# EAGLE design akabeacon_circle_MDBT40_type1 (EAGLE 9.6.2)
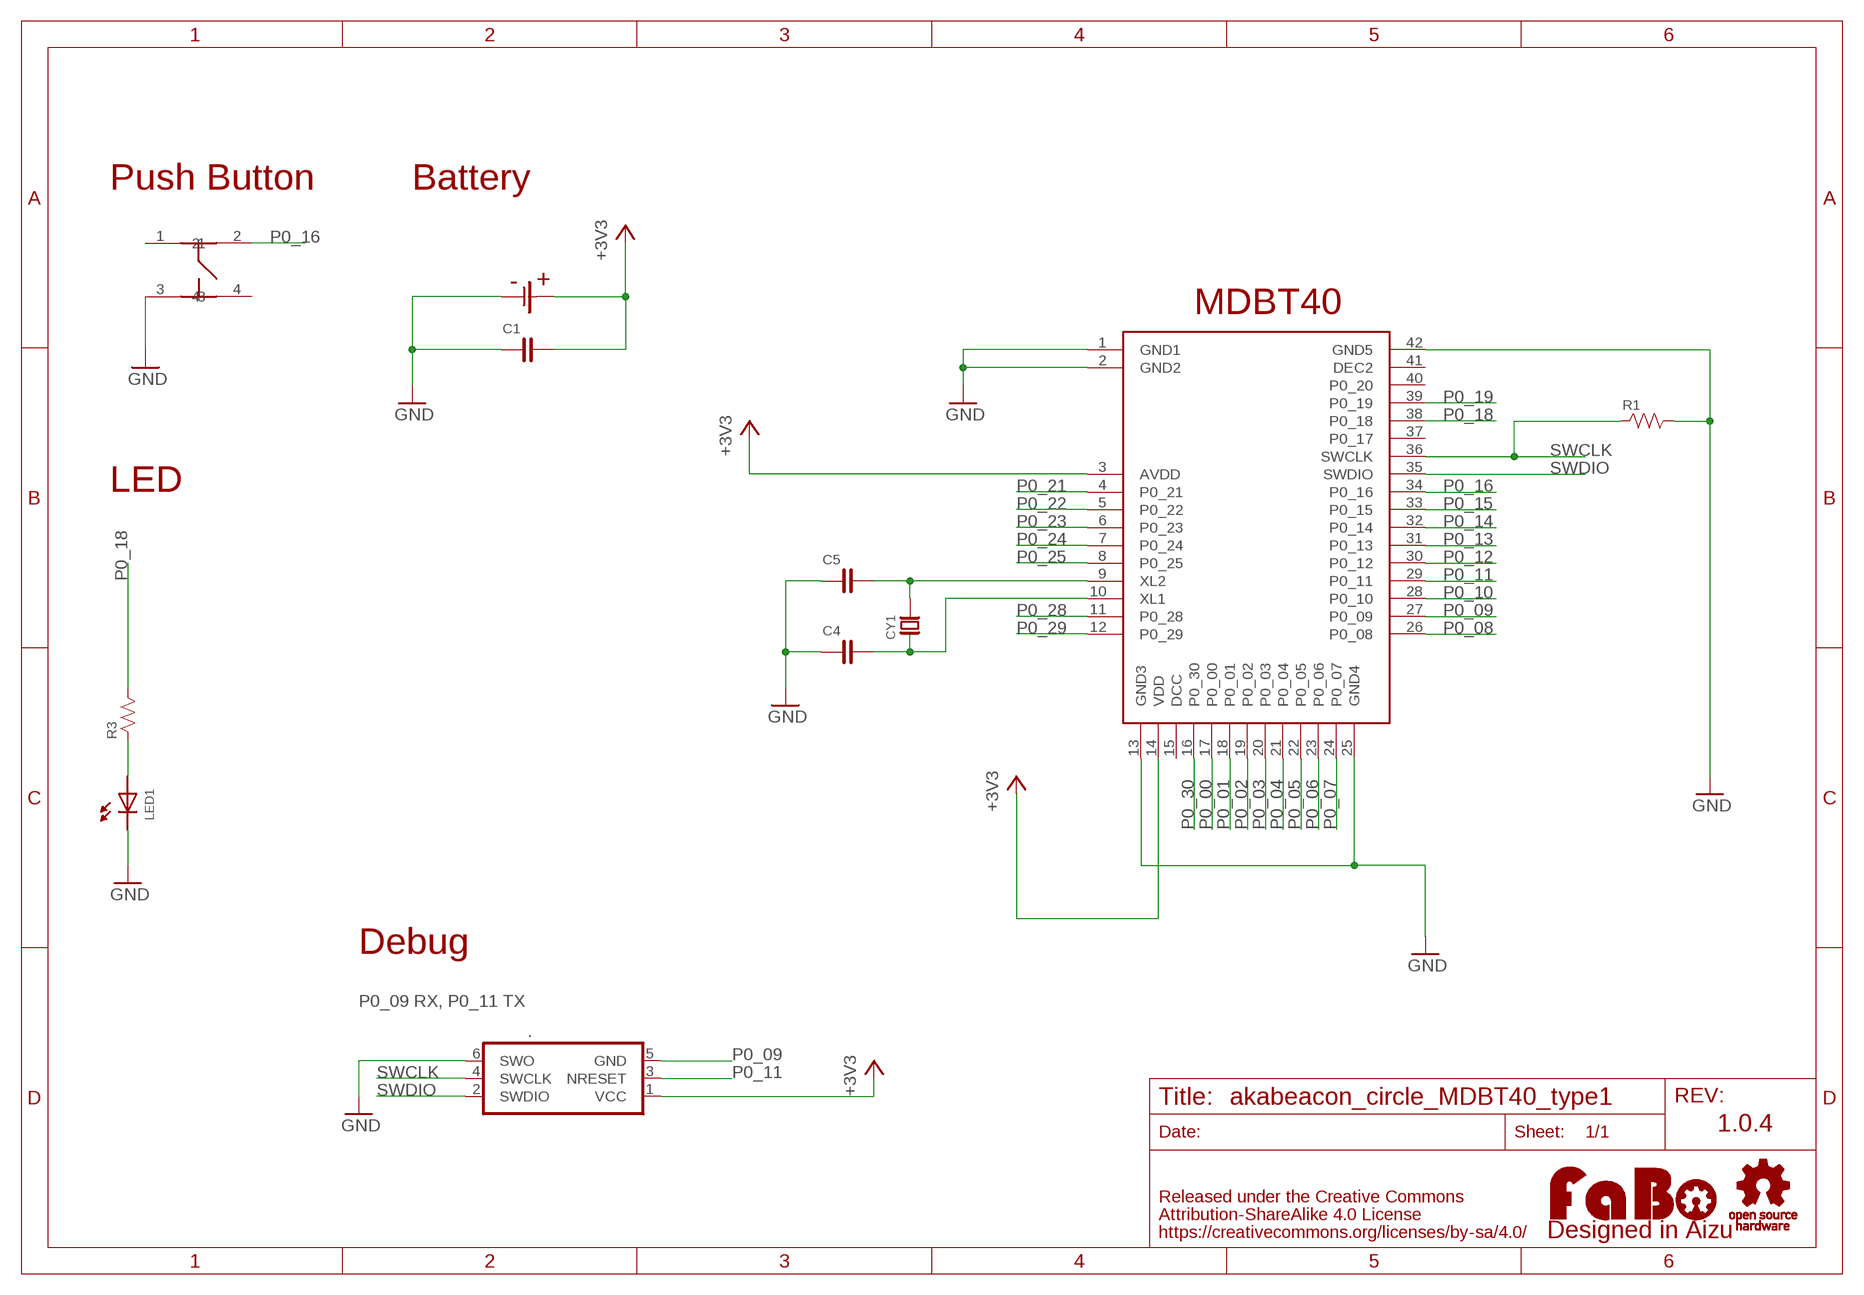
[diagram p0: schematic, sheet 1]

## Parts
.  TC2030-IDC-NL  [TC2030-IDC-NL]
C1  CAPACITOR-0603  [0603]
C4  CAPACITOR-0603  [0603]
C5  CAPACITOR-0603  [0603]
CY1  CRYSTALABS07  [ABRACON-ABS07-32.768KHZ]
LED1  LED-0603  [0603]
R1  RESISTOR-0603  [0603]
R3  RESISTOR-0603  [0603]
U$1  RAYTAC-MDBT40  [RAYTAC-MDBT40]
U$2  CH031-2477LF  [CH031-2477LF]
U$3  LOGO_FABO-M  [LOGO_FABO_MS]
U$4  LOGO_OSHW-M_BOTTOM  [LOGO_OSHW_M_BOTTOM]
U$5  SWICTH-4P(KMR2)  [SWITCH-4P(KMR2)]

## Nets
+3V3: ..1(VCC) C1.2 U$1.3(AVDD) U$1.14(VDD) U$2.+
GND: ..6(SWO) C1.1 C4.1 C5.1 LED1.CATHODE R1.2 U$1.1(GND1) U$1.2(GND2) U$1.13(GND3) U$1.25(GND4) U$1.42(GND5) U$2.- U$5.3
N$1: LED1.ANODE R3.1
N$7: C5.2 CY1.P$2 U$1.9(XL2)
N$8: C4.2 CY1.P$1 U$1.10(XL1)
P0_00: U$1.17(P0_00)
P0_01: U$1.18(P0_01)
P0_02: U$1.19(P0_02)
P0_03: U$1.20(P0_03)
P0_04: U$1.21(P0_04)
P0_05: U$1.22(P0_05)
P0_06: U$1.23(P0_06)
P0_07: U$1.24(P0_07)
P0_08: U$1.26(P0_08)
P0_09: ..5(GND) U$1.27(P0_09)
P0_10: U$1.28(P0_10)
P0_11: ..3(NRESET) U$1.29(P0_11)
P0_12: U$1.30(P0_12)
P0_13: U$1.31(P0_13)
P0_14: U$1.32(P0_14)
P0_15: U$1.33(P0_15)
P0_16: U$1.34(P0_16) U$5.2
P0_18: R3.2 U$1.38(P0_18)
P0_19: U$1.39(P0_19)
P0_21: U$1.4(P0_21)
P0_22: U$1.5(P0_22)
P0_23: U$1.6(P0_23)
P0_24: U$1.7(P0_24)
P0_25: U$1.8(P0_25)
P0_28: U$1.11(P0_28)
P0_29: U$1.12(P0_29)
P0_30: U$1.16(P0_30)
SWCLK: ..4(SWCLK) R1.1 U$1.36(SWCLK)
SWDIO: ..2(SWDIO) U$1.35(SWDIO)
Unconnected: U$1.15(DCC) U$1.37(P0_17) U$1.40(P0_20) U$1.41(DEC2) U$5.1 U$5.4

## Notes on the sheet
- Push Button | Battery
- MDBT40
- LED
- Debug
- P0_09 RX, P0_11 TX
- 1.0.4

## Library data of the parts
. = TagConnect:TC2030-IDC: Tag-Connect In Circuit Programming & Debug Cable 6 Pin http://www.tag-connect.com
C1 C4 C5 = FaBo-Capacitor:CAPACITOR: CAPACITOR
CY1 = FaBo-Crystal:CRYSTAL
LED1 = FaBo-LED:LED
R1 R3 = FaBo-Resistors:RESISTOR: RESISTOR
U$1 = FaBo-BT:RAYTAC-MDBT40
U$2 = FaBo-Supply:CH031-2477LF
U$3 = FaBo-Logo:LOGO_FABO
U$4 = FaBo-Logo:LOGO_OSHW
U$5 = gclue-test:SWICTH-4P(KMR2)

## Board
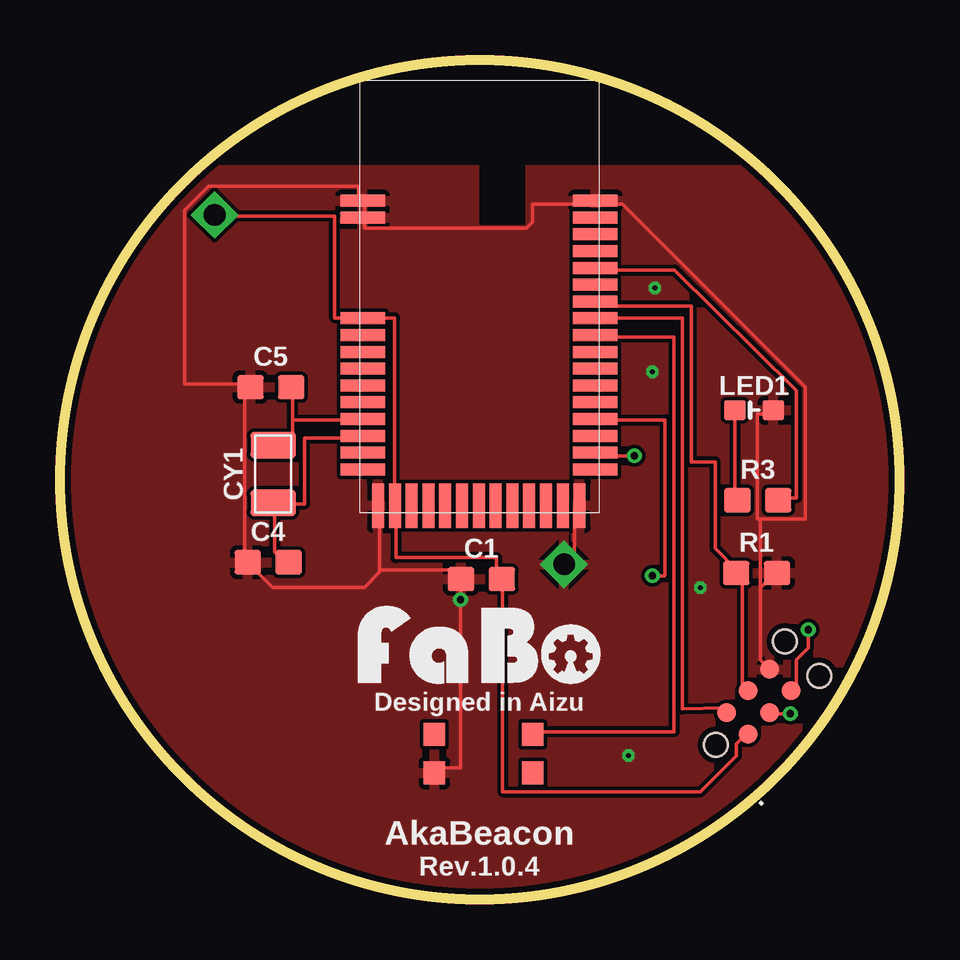
[diagram p1: board, top side]
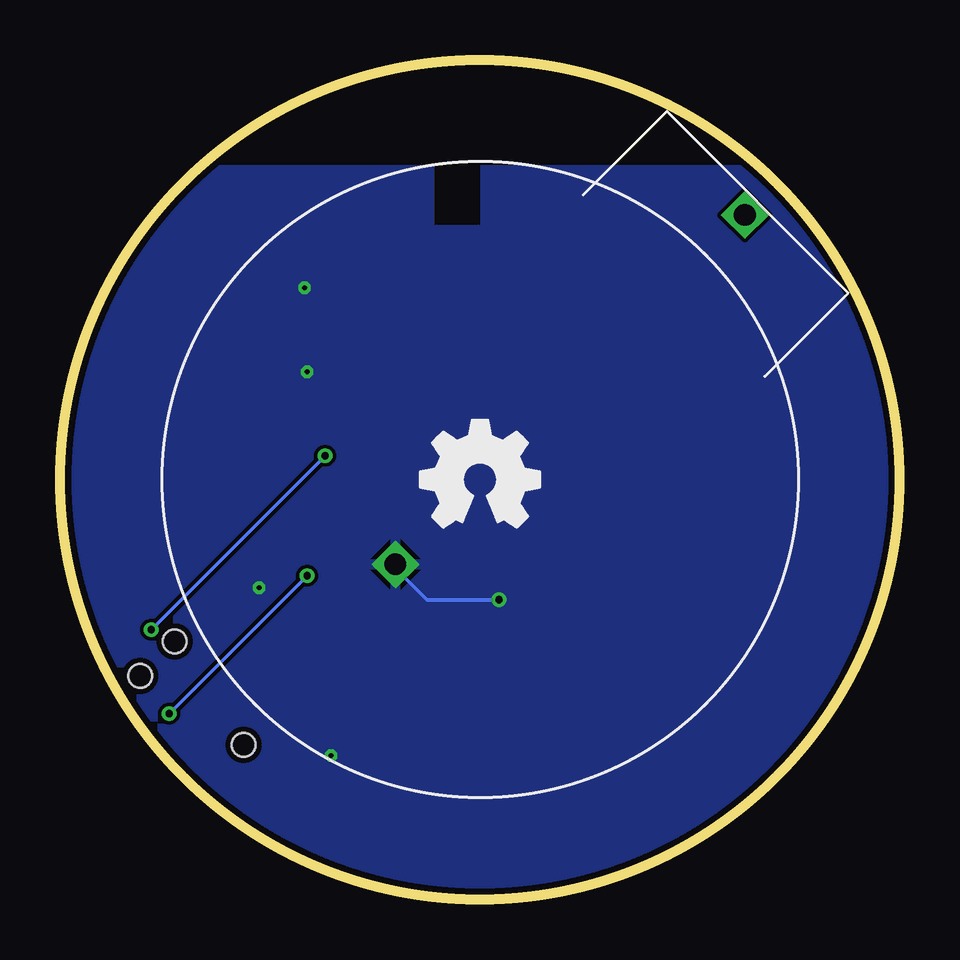
[diagram p2: board, bottom side, seen from below]

Size 35 x 35 mm. Coordinates in mm from the lower left corner, seen from the top.
Outline: circle at 17.5,17.5 radius 17.5
Copper layers (1*16): Top 0.035mm / dielectric 1.6mm / Bottom 0.035mm
Design rules "PCBway": minimum track width 6mil, minimum drill 12mil, track to track 6mil, track to pad 6mil, pad to pad 6mil, via to via 6mil, smd to smd 6mil, copper to edge 10mil, drill to drill 10mil, minimum pad ring 10mil, minimum via ring 6mil, stop-mask expansion 2mil, vias tented up to drill 100mil, thermal gap 8mil

### Footprints (pad centres in the part's own frame; a part is rotated, then mirrored left to right if it is on the bottom)
TC2030-IDC-NL = smd 0.787 x 0.787: 1 -1.27,-0.635; 2 -1.27,0.635; 3 0,-0.635; 4 0,0.635; 5 1.27,-0.635; 6 1.27,0.635 | hole 0.991: -2.54,0; 2.54,1.016; 2.54,-1.016
0603 = smd 1.1 x 1: 1 -0.85,0; 2 0.85,0
ABRACON-ABS07-32.768KHZ = smd 1.1 x 1.9: P$1 -1.2,0; P$2 1.2,0
0603' = smd 0.9 x 0.8: ANODE -0.8,0; CATHODE 0.8,0
RAYTAC-MDBT40 = smd 1.85 x 0.5: 1 -4.86,4; 2 -4.86,3.3; 3 -4.86,-0.9; 4 -4.86,-1.6; 5 -4.86,-2.3; 6 -4.86,-3; 7 -4.86,-3.7; 8 -4.86,-4.4; 9 -4.86,-5.1; 10 -4.86,-5.8; 11 -4.86,-6.5; 12 -4.86,-7.2; 26 4.84,-7.2; 27 4.84,-6.5; 28 4.84,-5.8; 29 4.84,-5.1; 30 4.84,-4.4; 31 4.84,-3.7; 32 4.84,-3; 33 4.84,-2.3; 34 4.84,-1.6; 35 4.84,-0.9; 36 4.84,-0.2; 37 4.84,0.5; 38 4.84,1.2; 39 4.84,1.9; 40 4.84,2.6; 41 4.84,3.3; 42 4.84,4 | smd 0.5 x 1.85: 13 -4.22,-8.71; 14 -3.52,-8.71; 15 -2.82,-8.71; 16 -2.12,-8.71; 17 -1.42,-8.71; 18 -0.72,-8.71; 19 -0.02,-8.71; 20 0.68,-8.71; 21 1.38,-8.71; 22 2.08,-8.71; 23 2.78,-8.71; 24 3.48,-8.71; 25 4.18,-8.71
CH031-2477LF = drill 0.9 square: + 0,15.6; - 0,-5
SWITCH-4P(KMR2) = smd 0.9 x 0.95: 1 -1,0; 2 3.1,0; 3 -1,-1.6; 4 3.1,-1.6

### Placement (x,y rotation side)
.  29.14,8.25 45 top
C1  17.57,13.36 0 top
C4  8.68,14.06 0 top
C5  8.79,21.36 0 top
CY1  8.89,17.74 90 top
LED1  [0603']  28.94,20.4 0 top
R1  29.04,13.61 0 top
R3  29.09,16.65 0 top
U$1  17.48,25.13 0 top
U$2  17.48,17.51 45 top
U$3  17.48,8.62 0 top
U$4  17.48,17.51 0 top
U$5  16.61,6.88 0 top

### Tracks (layer width: path | path; a pad name or v marks a point on that pad's centre or on a via)
+3V3
  Top 0.152: ..1 28.45,6.75 28.2,6.5 28.2,6 26.7,4.5 18.45,4.5 18.45,13.25 C1.2 18.2,13.5 18.2,14.25 14,14.25 14,16.38 U$1.14 13.95,16.5 13.95,24.25 12.7,24.25 U$1.3 12.45,24.25 11.45,24.25 11.45,28.5 6.45,28.5 U$2.+
GND  (via drill 0.2, 0.3)
  Top 0.152: U$1.25 21.45,16.25 21.45,14.25 21.2,14 U$2.- | 13.32,13.75 16.7,13.75 C1.1 16.7,13.25 v16.7,12.5 16.7,5.5 15.7,5.5 U$5.3 | 13.32,13.75 13.32,16.36 U$1.13 | 29.2,13 29.2,10 29.45,9.75 ..6 | 29.2,13 29.7,13.5 R1.2 | 29.2,13 29.2,15.87 | LED1.CATHODE 29.45,20.25 29.07,20.25 29.07,15.87 29.2,15.87 | 29.2,15.87 31.08,15.87 31.08,21.37 23.45,29 22.45,29 U$1.42 22.2,29 19.7,29 19.7,28.25 19.45,28 12.7,28 12.7,28.25 U$1.2 12.7,28.5 12.7,29 U$1.1 12.45,29.25 12.45,29.75 6.2,29.75 5.2,28.75 5.2,21.5 7.95,21.5 C5.1 7.95,21.25 7.7,21 7.7,14.25 C4.1 8.87,13.02 12.69,13.02 13.32,13.65 13.32,13.75
  Bottom 0.152: v16.7,12.5 19.7,12.5 20.95,13.75 U$2.-
  other vias: 24.8,25.5 24.7,22 26.7,13 23.7,6
  pour Bottom: -0.3,0 34.7,0 34.7,35 -0.3,35
  pour Top: -0.3,0 34.7,0 34.7,35 -0.3,35
N$1
  Top 0.152: LED1.ANODE 28.14,16.75 R3.1
N$7
  Top 0.152: 9.7,20 9.7,19.25 CY1.P$2 | 9.7,20 9.7,21 9.45,21.25 C5.2 | 9.7,20 12.45,20 U$1.9
N$8
  Top 0.152: C4.2 9.2,14.25 8.95,14.5 8.95,16.25 CY1.P$1 8.95,16.5 10.2,16.5 10.2,19.25 12.45,19.25 U$1.10
P0_09  (via drill 0.3)
  Top 0.152: v31.2,11.25 31.2,10.5 30.7,10 30.7,8.75 ..5 | v23.95,18.5 22.45,18.5 U$1.27
  Bottom 0.152: v23.95,18.5 v31.2,11.25
P0_11  (via drill 0.3)
  Top 0.152: v30.45,7.75 29.7,7.75 ..3 | v24.7,13.5 25.2,13.5 25.22,13.52 25.22,20 22.45,20 U$1.29
  Bottom 0.152: v24.7,13.5 v30.45,7.75
P0_16
  Top 0.152: U$1.34 22.4,23.45 25.6,23.45 25.6,7 19.95,7 U$5.2
P0_18
  Top 0.152: R3.2 29.95,16.75 30.7,16.75 30.7,21.22 25.62,26.25 22.45,26.25 U$1.38
SWCLK
  Top 0.152: ..4 28.45,8.75 28.45,13.5 R1.1 28.2,13.75 27.32,14.63 27.32,18.25 26.33,18.25 26.33,24.75 22.45,24.75 U$1.36
SWDIO
  Top 0.152: ..2 27.7,8 25.95,7.95 25.95,24.25 22.45,24.25 U$1.35

### Text on the board
tPlace: Designed in Aizu | AkaBeacon | Rev.1.0.4